# Altium schematic sheet UART_Serial_Port.SchDoc
size A; DocumentNumber: 1; SheetNumber: 1; SheetTotal: 1
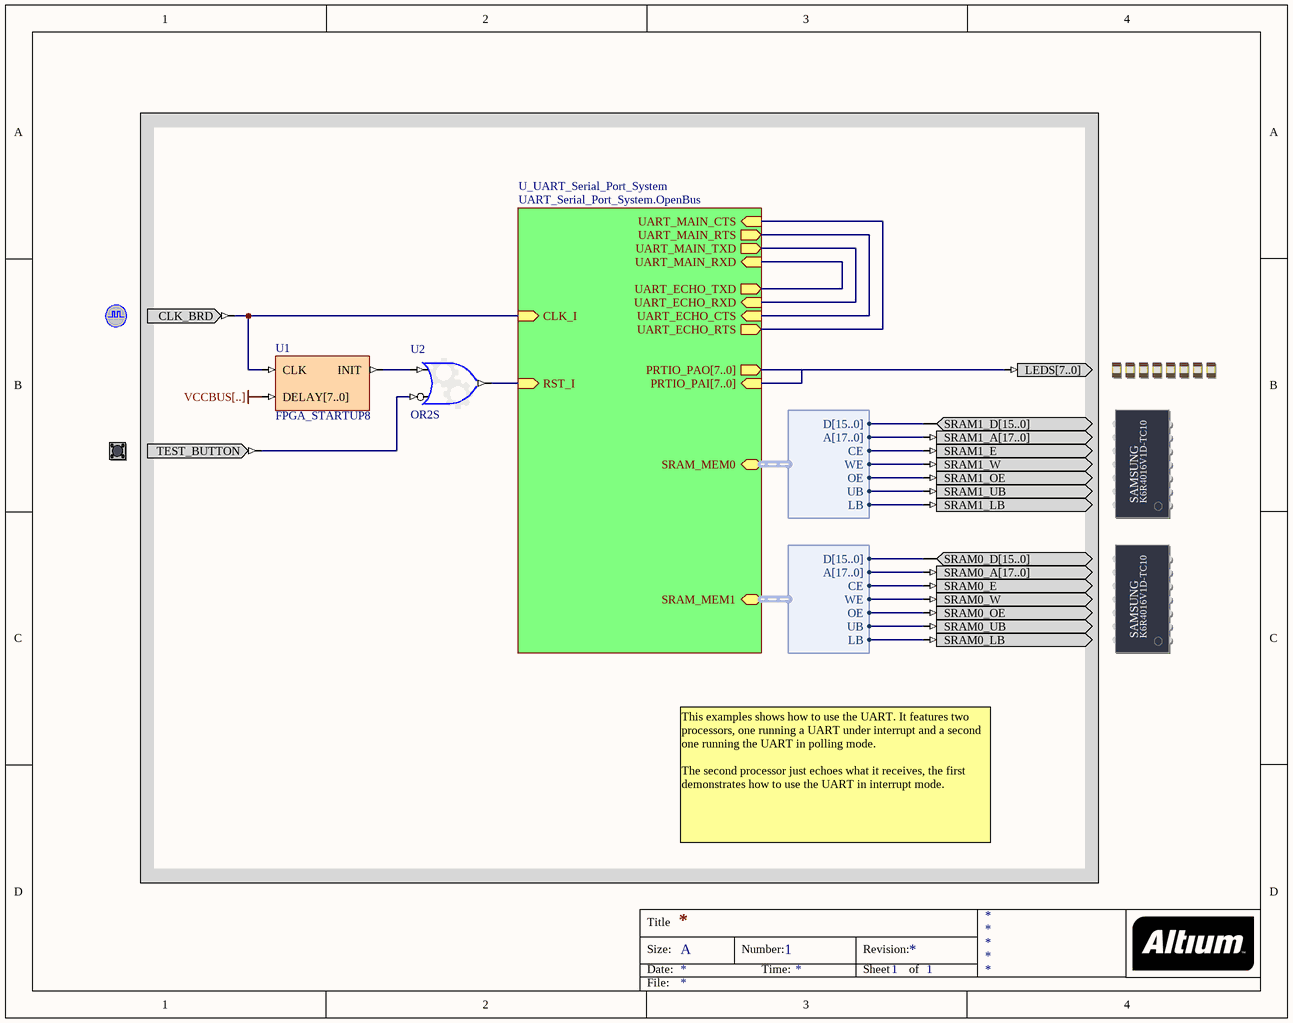
[diagram p0: UART_Serial_Port.SchDoc]

## Parts
(Parts that share a designator on the sheet are numbered #1, #2 ... from top to bottom, then left to right.)
?#1  CLOCK_BOARD  (value not drawn)
?#2  LED  (value not drawn)
?#3  SRAM_DAUGHTER1  (value not drawn)
?#4  TEST_BUTTON  (value not drawn)
?#5  SRAM_DAUGHTER0  (value not drawn)
U1  FPGA_STARTUP8
U2  OR2S

## Sub-sheets
U_UART_Serial_Port_System = UART_Serial_Port_System.OpenBus: CLK_I (in), RST_I (in), PRTIO_PAO[7..0] (out), PRTIO_PAI[7..0] (in), UART_ECHO_CTS (in), UART_ECHO_RXD (in), UART_ECHO_RTS (out), UART_ECHO_TXD (out), UART_MAIN_CTS (in), UART_MAIN_RXD (in), UART_MAIN_RTS (out), UART_MAIN_TXD (out), SRAM_MEM0 (harness WB_MEM_CTRL_SRAM16_A18), SRAM_MEM1 (harness WB_MEM_CTRL_SRAM16_A18)

## Harnesses
WB_MEM_CTRL_SRAM16_A18: D[15..0], A[17..0], CE, WE, OE, UB, LB

## Nets
VCCBUS[..]: U1.DELAY[7..0]
Net?#1_CLK_BRD: ?#1.CLK_BRD U1.CLK ; sheet U_UART_Serial_Port_System/CLK_I
Net?#2_LEDS[7..0]: ?#2.LEDS[7..0] ; sheet U_UART_Serial_Port_System/PRTIO_PAO[7..0], sheet U_UART_Serial_Port_System/PRTIO_PAI[7..0]
Net?#3_SRAM1_A[17..0]: ?#3.SRAM1_A[17..0] ; sheet U_UART_Serial_Port_System/SRAM_MEM0.A[17..0]
Net?#3_SRAM1_D[15..0]: ?#3.SRAM1_D[15..0] ; sheet U_UART_Serial_Port_System/SRAM_MEM0.D[15..0]
Net?#3_SRAM1_E: ?#3.SRAM1_E ; sheet U_UART_Serial_Port_System/SRAM_MEM0.CE
Net?#3_SRAM1_LB: ?#3.SRAM1_LB ; sheet U_UART_Serial_Port_System/SRAM_MEM0.LB
Net?#3_SRAM1_OE: ?#3.SRAM1_OE ; sheet U_UART_Serial_Port_System/SRAM_MEM0.OE
Net?#3_SRAM1_UB: ?#3.SRAM1_UB ; sheet U_UART_Serial_Port_System/SRAM_MEM0.UB
Net?#3_SRAM1_W: ?#3.SRAM1_W ; sheet U_UART_Serial_Port_System/SRAM_MEM0.WE
Net?#4_TEST_BUTTON: ?#4.TEST_BUTTON U2.I1
Net?#5_SRAM0_A[17..0]: ?#5.SRAM0_A[17..0] ; sheet U_UART_Serial_Port_System/SRAM_MEM1.A[17..0]
Net?#5_SRAM0_D[15..0]: ?#5.SRAM0_D[15..0] ; sheet U_UART_Serial_Port_System/SRAM_MEM1.D[15..0]
Net?#5_SRAM0_E: ?#5.SRAM0_E ; sheet U_UART_Serial_Port_System/SRAM_MEM1.CE
Net?#5_SRAM0_LB: ?#5.SRAM0_LB ; sheet U_UART_Serial_Port_System/SRAM_MEM1.LB
Net?#5_SRAM0_OE: ?#5.SRAM0_OE ; sheet U_UART_Serial_Port_System/SRAM_MEM1.OE
Net?#5_SRAM0_UB: ?#5.SRAM0_UB ; sheet U_UART_Serial_Port_System/SRAM_MEM1.UB
Net?#5_SRAM0_W: ?#5.SRAM0_W ; sheet U_UART_Serial_Port_System/SRAM_MEM1.WE
NetU1_INIT: U1.INIT U2.I0
NetU2_O: U2.O ; sheet U_UART_Serial_Port_System/RST_I
(unnamed): sheet U_UART_Serial_Port_System/UART_ECHO_CTS, sheet U_UART_Serial_Port_System/UART_MAIN_RTS
(unnamed): sheet U_UART_Serial_Port_System/UART_ECHO_RXD, sheet U_UART_Serial_Port_System/UART_MAIN_TXD
(unnamed): sheet U_UART_Serial_Port_System/UART_ECHO_RTS, sheet U_UART_Serial_Port_System/UART_MAIN_CTS
(unnamed): sheet U_UART_Serial_Port_System/UART_ECHO_TXD, sheet U_UART_Serial_Port_System/UART_MAIN_RXD

## Buses and harness runs
bus sheet U_UART_Serial_Port_System/PRTIO_PAI[7..0] = sheet U_UART_Serial_Port_System/PRTIO_PAO[7..0]

## Notes on the sheet
- This examples shows how to use the UART. It features two processors, one running a UART under interrupt and a second one running the UART in polling mode.
  The second processor just echoes what it receives, the first demonstrates how to use the UART in interrupt mode.
- Title
- Size:
- Date:
- A
- Number:
- Time:
- Revision:
- Sheet
- of
- File:
- (in symbol SRAM_DAUGHTER0) SAMSUNG; K6R4016V1D-TC10
- (in symbol SRAM_DAUGHTER1) SAMSUNG; K6R4016V1D-TC10

## Library data of the parts
?#1 = CLOCK_BOARD: Global System Clock Supply; PortComponent: True; Published: 19-Nov-2003; Publisher: Altium Limited; HelpURL: TR0143 Technical Reference Manual for Altium's Desktop NanoBoard NB2DSK01.pdf#page=41; UseInDSF: True
?#2 = LED: Bank of eight Red LEDs; PortComponent: True; Published: 19-Nov-2003; Publisher: Altium Limited; HelpURL: TR0143 Technical Reference Manual for Altium's Desktop NanoBoard NB2DSK01.pdf#page=51
?#3 = SRAM_DAUGHTER1: Free Static RAM - Daughterboard; PortComponent: True; Published: 14-May-2007; Publisher: Altium Limited; HelpURL: TR0143 NanoBoard Technical Reference Manual - NB2.pdf#page=24
?#4 = TEST_BUTTON: Test / Reset Button; PortComponent: True; Published: 19-Nov-2003; Publisher: Altium Limited; HelpURL: TR0143 Technical Reference Manual for Altium's Desktop NanoBoard NB2DSK01.pdf#page=53
?#5 = SRAM_DAUGHTER0: Free Static RAM - Daughterboard; PortComponent: True; Published: 14-May-2007; Publisher: Altium Limited; HelpURL: TR0143 NanoBoard Technical Reference Manual - NB2.pdf#page=24
U1 = FPGA_STARTUP8: FPGA Startup With 8 Bit Delay; Published: 9-Dec-2004; Publisher: Altium Limited; HelpURL: CR0119 FPGA_STARTUPx Powerup Delay Unit.pdf; LastRevisionNo: 1.00.00; ComponentLink1Description: Core &Resource Usage; ComponentLink1URL: CR0139 FPGA Peripheral Resource Usage.pdf#page=11
U2 = GATE: Configurable Generic Gate; ConfiguratorName: GENERIC_GATE; ConfigurationParameters: {}Version[1.0]{}GateKind[OR]{}BusInput[False]{}GateInputType[Bit]{}GateOutputOption[Normal]{}BusWidth[8]{}RegisterOutputs[False]{}NegativeClockEdge[False]{}InputCount[2]{}InputInvert0[False]{}InputInvert1[True]{}; LastRevisionNo: 1.00.00; Published: 3-Sep-2008; Publisher: Altium Limited